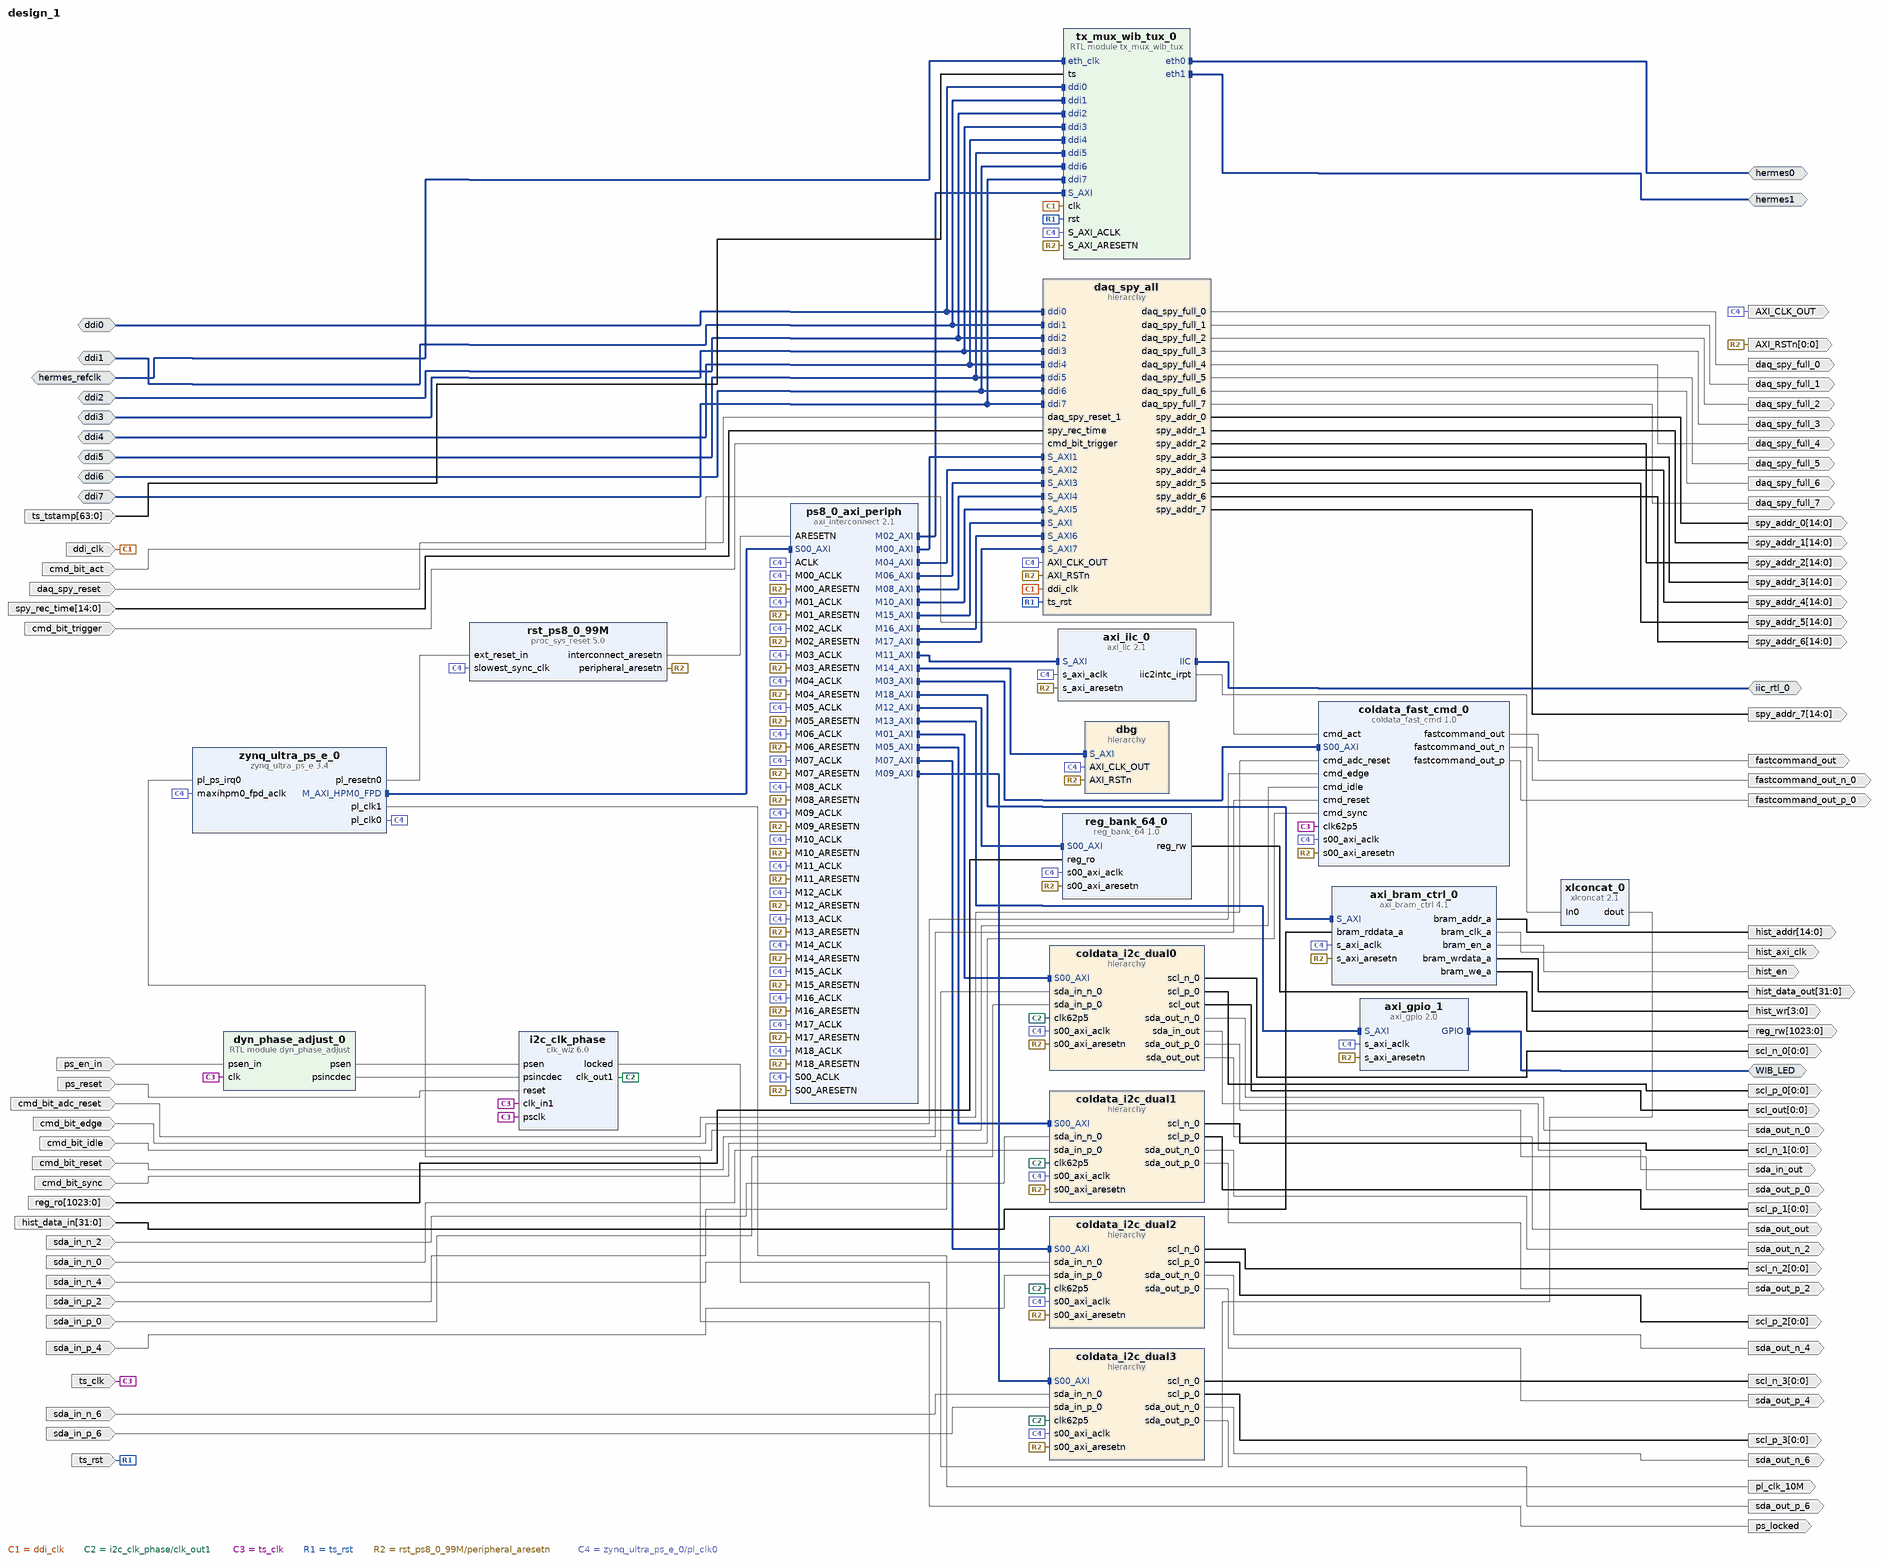
[diagram p0: block diagram of the top level]
# Vivado block design design_1, xczu6cg-ffvb1156-1-e, Vivado 2022.2.2
create_bd_design design_1

create_bd_intf_port -mode Master -vlnv xilinx.com:interface:gpio_rtl:1.0 WIB_LED
create_bd_intf_port -mode Master -vlnv xilinx.com:interface:iic_rtl:1.0 iic_rtl_0
create_bd_intf_port -mode Slave -vlnv xilinx.com:interface:diff_clock_rtl:1.0 hermes_refclk
set_property -dict {CONFIG.FREQ_HZ 125} [get_bd_intf_ports hermes_refclk]
create_bd_intf_port -mode Slave -vlnv UF:user:deimos_data_input_rtl:1.0 ddi0
create_bd_intf_port -mode Slave -vlnv UF:user:deimos_data_input_rtl:1.0 ddi6
create_bd_intf_port -mode Slave -vlnv UF:user:deimos_data_input_rtl:1.0 ddi5
create_bd_intf_port -mode Slave -vlnv UF:user:deimos_data_input_rtl:1.0 ddi1
create_bd_intf_port -mode Slave -vlnv UF:user:deimos_data_input_rtl:1.0 ddi2
create_bd_intf_port -mode Slave -vlnv UF:user:deimos_data_input_rtl:1.0 ddi3
create_bd_intf_port -mode Slave -vlnv UF:user:deimos_data_input_rtl:1.0 ddi4
create_bd_intf_port -mode Slave -vlnv UF:user:deimos_data_input_rtl:1.0 ddi7
create_bd_intf_port -mode Master -vlnv xilinx.com:interface:sgmii_rtl:1.0 hermes0
create_bd_intf_port -mode Master -vlnv xilinx.com:interface:sgmii_rtl:1.0 hermes1
create_bd_port -dir O -type clk AXI_CLK_OUT
create_bd_port -dir O -from 0 -to 0 -type rst AXI_RSTn
create_bd_port -dir I -type rst daq_spy_reset
create_bd_port -dir O fastcommand_out_n_0
create_bd_port -dir O fastcommand_out_p_0
create_bd_port -dir I ps_en_in
create_bd_port -dir O ps_locked
create_bd_port -dir I -type rst ps_reset
set_property -dict {CONFIG.POLARITY ACTIVE_HIGH} [get_bd_ports ps_reset]
create_bd_port -dir I -from 1023 -to 0 reg_ro
create_bd_port -dir O -from 1023 -to 0 reg_rw
create_bd_port -dir O -from 0 -to 0 scl_n_0
create_bd_port -dir O -from 0 -to 0 scl_n_1
create_bd_port -dir O -from 0 -to 0 scl_n_2
create_bd_port -dir O -from 0 -to 0 scl_n_3
create_bd_port -dir O -from 0 -to 0 scl_p_0
create_bd_port -dir O -from 0 -to 0 scl_p_1
create_bd_port -dir O -from 0 -to 0 scl_p_2
create_bd_port -dir O -from 0 -to 0 scl_p_3
create_bd_port -dir I sda_in_n_0
create_bd_port -dir I sda_in_n_2
create_bd_port -dir I sda_in_n_4
create_bd_port -dir I sda_in_n_6
create_bd_port -dir I sda_in_p_0
create_bd_port -dir I sda_in_p_2
create_bd_port -dir I sda_in_p_4
create_bd_port -dir I sda_in_p_6
create_bd_port -dir O sda_out_n_0
create_bd_port -dir O sda_out_n_2
create_bd_port -dir O sda_out_n_4
create_bd_port -dir O sda_out_n_6
create_bd_port -dir O sda_out_p_0
create_bd_port -dir O sda_out_p_2
create_bd_port -dir O sda_out_p_4
create_bd_port -dir O sda_out_p_6
create_bd_port -dir I -from 14 -to 0 spy_rec_time
create_bd_port -dir O -type clk pl_clk_10M
set_property -dict {CONFIG.FREQ_HZ 10000000} [get_bd_ports pl_clk_10M]
create_bd_port -dir I cmd_bit_idle
create_bd_port -dir I cmd_bit_edge
create_bd_port -dir I cmd_bit_sync
create_bd_port -dir I cmd_bit_act
create_bd_port -dir I -type rst cmd_bit_reset
create_bd_port -dir I -type rst cmd_bit_adc_reset
create_bd_port -dir I cmd_bit_trigger
create_bd_port -dir O fastcommand_out
create_bd_port -dir O sda_in_out
create_bd_port -dir O sda_out_out
create_bd_port -dir O -from 0 -to 0 scl_out
create_bd_port -dir I -type clk ts_clk
set_property -dict {CONFIG.FREQ_HZ 62500000} [get_bd_ports ts_clk]
create_bd_port -dir I -from 63 -to 0 ts_tstamp
create_bd_port -dir I -type rst ts_rst
create_bd_port -dir I -type clk ddi_clk
set_property -dict {CONFIG.ASSOCIATED_RESET daq_spy_reset:daq_spy_reset_0:ts_rst CONFIG.FREQ_HZ 62500000} [get_bd_ports ddi_clk]
create_bd_port -dir O -from 14 -to 0 spy_addr_3
create_bd_port -dir O -from 14 -to 0 spy_addr_6
create_bd_port -dir O -from 14 -to 0 spy_addr_4
create_bd_port -dir O daq_spy_full_4
create_bd_port -dir O -from 14 -to 0 spy_addr_5
create_bd_port -dir O daq_spy_full_5
create_bd_port -dir O daq_spy_full_6
create_bd_port -dir O daq_spy_full_1
create_bd_port -dir O daq_spy_full_7
create_bd_port -dir O daq_spy_full_3
create_bd_port -dir O -from 14 -to 0 spy_addr_0
create_bd_port -dir O -from 14 -to 0 spy_addr_7
create_bd_port -dir O -from 14 -to 0 spy_addr_2
create_bd_port -dir O -from 14 -to 0 spy_addr_1
create_bd_port -dir O daq_spy_full_0
create_bd_port -dir O daq_spy_full_2
create_bd_port -dir I -from 31 -to 0 hist_data_in
create_bd_port -dir O -from 31 -to 0 hist_data_out
create_bd_port -dir O -from 14 -to 0 hist_addr
create_bd_port -dir O -type clk hist_axi_clk
create_bd_port -dir O hist_en
create_bd_port -dir O -from 3 -to 0 hist_wr

create_bd_cell -type ip -vlnv user.org:user:coldata_fast_cmd:1.0 coldata_fast_cmd_0
create_bd_cell -type hier coldata_i2c_dual0
create_bd_cell -type hier coldata_i2c_dual1
create_bd_cell -type hier coldata_i2c_dual2
create_bd_cell -type hier coldata_i2c_dual3
create_bd_cell -type hier dbg
create_bd_cell -type module -reference dyn_phase_adjust dyn_phase_adjust_0
create_bd_cell -type ip -vlnv user.org:user:reg_bank_64:1.0 reg_bank_64_0
create_bd_cell -type ip -vlnv xilinx.com:ip:proc_sys_reset:5.0 rst_ps8_0_99M
create_bd_cell -type ip -vlnv xilinx.com:ip:axi_gpio:2.0 axi_gpio_1
set_property -dict [list \
  CONFIG.C_ALL_INPUTS 0 \
  CONFIG.C_ALL_OUTPUTS 1 \
  CONFIG.C_DOUT_DEFAULT 0x0000005a \
  CONFIG.GPIO_BOARD_INTERFACE Custom \
  CONFIG.USE_BOARD_FLOW true \
] [get_bd_cells axi_gpio_1]
create_bd_cell -type ip -vlnv xilinx.com:ip:axi_iic:2.1 axi_iic_0
set_property -dict {CONFIG.IIC_BOARD_INTERFACE Custom CONFIG.USE_BOARD_FLOW true} [get_bd_cells axi_iic_0]
create_bd_cell -type ip -vlnv xilinx.com:ip:clk_wiz:6.0 i2c_clk_phase
set_property -dict [list \
  CONFIG.CLKIN1_JITTER_PS 160.0 \
  CONFIG.CLKOUT1_JITTER 142.224 \
  CONFIG.CLKOUT1_PHASE_ERROR 131.709 \
  CONFIG.CLKOUT1_REQUESTED_OUT_FREQ 62.5 \
  CONFIG.CLK_OUT1_USE_FINE_PS_GUI true \
  CONFIG.MMCM_CLKFBOUT_MULT_F 19.000 \
  CONFIG.MMCM_CLKIN1_PERIOD 16.000 \
  CONFIG.MMCM_CLKIN2_PERIOD 10.0 \
  CONFIG.MMCM_CLKOUT0_DIVIDE_F 19.000 \
  CONFIG.MMCM_CLKOUT0_USE_FINE_PS true \
  CONFIG.MMCM_DIVCLK_DIVIDE 1 \
  CONFIG.USE_DYN_PHASE_SHIFT true \
] [get_bd_cells i2c_clk_phase]
create_bd_cell -type ip -vlnv xilinx.com:ip:axi_interconnect:2.1 ps8_0_axi_periph
set_property -dict {CONFIG.NUM_MI 19} [get_bd_cells ps8_0_axi_periph]
create_bd_cell -type ip -vlnv xilinx.com:ip:zynq_ultra_ps_e:3.4 zynq_ultra_ps_e_0
set_property -dict [list \
  CONFIG.CAN0_BOARD_INTERFACE custom \
  CONFIG.CAN1_BOARD_INTERFACE custom \
  CONFIG.CSU_BOARD_INTERFACE custom \
  CONFIG.DP_BOARD_INTERFACE custom \
  CONFIG.GEM0_BOARD_INTERFACE custom \
  CONFIG.GEM1_BOARD_INTERFACE custom \
  CONFIG.GEM2_BOARD_INTERFACE custom \
  CONFIG.GEM3_BOARD_INTERFACE custom \
  CONFIG.GPIO_BOARD_INTERFACE custom \
  CONFIG.IIC0_BOARD_INTERFACE custom \
  CONFIG.IIC1_BOARD_INTERFACE custom \
  CONFIG.NAND_BOARD_INTERFACE custom \
  CONFIG.PCIE_BOARD_INTERFACE custom \
  CONFIG.PJTAG_BOARD_INTERFACE custom \
  CONFIG.PMU_BOARD_INTERFACE custom \
  CONFIG.PSU_BANK_0_IO_STANDARD LVCMOS18 \
  CONFIG.PSU_BANK_1_IO_STANDARD LVCMOS18 \
  CONFIG.PSU_BANK_2_IO_STANDARD LVCMOS18 \
  CONFIG.PSU_BANK_3_IO_STANDARD LVCMOS18 \
  CONFIG.PSU_DYNAMIC_DDR_CONFIG_EN 1 \
  CONFIG.PSU_USB3__DUAL_CLOCK_ENABLE 0 \
  CONFIG.PSU__ACPU2__POWER__ON 0 \
  CONFIG.PSU__ACPU3__POWER__ON 0 \
  CONFIG.PSU__CAN1__PERIPHERAL__ENABLE 1 \
  CONFIG.PSU__CAN1__PERIPHERAL__IO {MIO 24 .. 25} \
  CONFIG.PSU__CRF_APB__ACPU_CTRL__FREQMHZ 1200 \
  CONFIG.PSU__CRF_APB__ACPU_CTRL__SRCSEL APLL \
  CONFIG.PSU__CRF_APB__APLL_CTRL__SRCSEL PSS_REF_CLK \
  CONFIG.PSU__CRF_APB__DBG_FPD_CTRL__FREQMHZ 250 \
  CONFIG.PSU__CRF_APB__DBG_FPD_CTRL__SRCSEL IOPLL \
  CONFIG.PSU__CRF_APB__DBG_TRACE_CTRL__FREQMHZ 250 \
  CONFIG.PSU__CRF_APB__DBG_TRACE_CTRL__SRCSEL IOPLL \
  CONFIG.PSU__CRF_APB__DBG_TSTMP_CTRL__FREQMHZ 250 \
  CONFIG.PSU__CRF_APB__DBG_TSTMP_CTRL__SRCSEL IOPLL \
  CONFIG.PSU__CRF_APB__DDR_CTRL__FREQMHZ 1067 \
  CONFIG.PSU__CRF_APB__DDR_CTRL__SRCSEL DPLL \
  CONFIG.PSU__CRF_APB__DPDMA_REF_CTRL__FREQMHZ 600 \
  CONFIG.PSU__CRF_APB__DPDMA_REF_CTRL__SRCSEL APLL \
  CONFIG.PSU__CRF_APB__DPLL_CTRL__SRCSEL PSS_REF_CLK \
  CONFIG.PSU__CRF_APB__DP_AUDIO_REF_CTRL__SRCSEL RPLL \
  CONFIG.PSU__CRF_APB__DP_STC_REF_CTRL__SRCSEL RPLL \
  CONFIG.PSU__CRF_APB__DP_VIDEO_REF_CTRL__SRCSEL VPLL \
  CONFIG.PSU__CRF_APB__GDMA_REF_CTRL__FREQMHZ 600 \
  CONFIG.PSU__CRF_APB__GDMA_REF_CTRL__SRCSEL APLL \
  CONFIG.PSU__CRF_APB__GPU_REF_CTRL__FREQMHZ 500 \
  CONFIG.PSU__CRF_APB__GPU_REF_CTRL__SRCSEL IOPLL \
  CONFIG.PSU__CRF_APB__TOPSW_LSBUS_CTRL__FREQMHZ 100 \
  CONFIG.PSU__CRF_APB__TOPSW_LSBUS_CTRL__SRCSEL IOPLL \
  CONFIG.PSU__CRF_APB__TOPSW_MAIN_CTRL__FREQMHZ 533.33 \
  CONFIG.PSU__CRF_APB__TOPSW_MAIN_CTRL__SRCSEL DPLL \
  CONFIG.PSU__CRF_APB__VPLL_CTRL__SRCSEL PSS_REF_CLK \
  CONFIG.PSU__CRL_APB__ADMA_REF_CTRL__FREQMHZ 500 \
  CONFIG.PSU__CRL_APB__ADMA_REF_CTRL__SRCSEL IOPLL \
  CONFIG.PSU__CRL_APB__CAN1_REF_CTRL__FREQMHZ 100 \
  CONFIG.PSU__CRL_APB__CAN1_REF_CTRL__SRCSEL IOPLL \
  CONFIG.PSU__CRL_APB__CPU_R5_CTRL__FREQMHZ 500 \
  CONFIG.PSU__CRL_APB__CPU_R5_CTRL__SRCSEL IOPLL \
  CONFIG.PSU__CRL_APB__DBG_LPD_CTRL__FREQMHZ 250 \
  CONFIG.PSU__CRL_APB__DBG_LPD_CTRL__SRCSEL IOPLL \
  CONFIG.PSU__CRL_APB__GEM3_REF_CTRL__FREQMHZ 125 \
  CONFIG.PSU__CRL_APB__GEM3_REF_CTRL__SRCSEL IOPLL \
  CONFIG.PSU__CRL_APB__I2C0_REF_CTRL__FREQMHZ 100 \
  CONFIG.PSU__CRL_APB__I2C0_REF_CTRL__SRCSEL IOPLL \
  CONFIG.PSU__CRL_APB__I2C1_REF_CTRL__FREQMHZ 100 \
  CONFIG.PSU__CRL_APB__I2C1_REF_CTRL__SRCSEL IOPLL \
  CONFIG.PSU__CRL_APB__IOPLL_CTRL__SRCSEL PSS_REF_CLK \
  CONFIG.PSU__CRL_APB__IOU_SWITCH_CTRL__FREQMHZ 250 \
  CONFIG.PSU__CRL_APB__IOU_SWITCH_CTRL__SRCSEL IOPLL \
  CONFIG.PSU__CRL_APB__LPD_LSBUS_CTRL__FREQMHZ 100 \
  CONFIG.PSU__CRL_APB__LPD_LSBUS_CTRL__SRCSEL IOPLL \
  CONFIG.PSU__CRL_APB__LPD_SWITCH_CTRL__FREQMHZ 500 \
  CONFIG.PSU__CRL_APB__LPD_SWITCH_CTRL__SRCSEL IOPLL \
  CONFIG.PSU__CRL_APB__PCAP_CTRL__FREQMHZ 200 \
  CONFIG.PSU__CRL_APB__PCAP_CTRL__SRCSEL IOPLL \
  CONFIG.PSU__CRL_APB__PL0_REF_CTRL__FREQMHZ 100 \
  CONFIG.PSU__CRL_APB__PL0_REF_CTRL__SRCSEL IOPLL \
  CONFIG.PSU__CRL_APB__PL1_REF_CTRL__FREQMHZ 10 \
  CONFIG.PSU__CRL_APB__QSPI_REF_CTRL__FREQMHZ 125 \
  CONFIG.PSU__CRL_APB__QSPI_REF_CTRL__SRCSEL IOPLL \
  CONFIG.PSU__CRL_APB__RPLL_CTRL__SRCSEL PSS_REF_CLK \
  CONFIG.PSU__CRL_APB__SDIO1_REF_CTRL__FREQMHZ 200 \
  CONFIG.PSU__CRL_APB__SDIO1_REF_CTRL__SRCSEL IOPLL \
  CONFIG.PSU__CRL_APB__TIMESTAMP_REF_CTRL__FREQMHZ 100 \
  CONFIG.PSU__CRL_APB__TIMESTAMP_REF_CTRL__SRCSEL IOPLL \
  CONFIG.PSU__CRL_APB__UART0_REF_CTRL__FREQMHZ 100 \
  CONFIG.PSU__CRL_APB__UART0_REF_CTRL__SRCSEL IOPLL \
  CONFIG.PSU__CRL_APB__UART1_REF_CTRL__FREQMHZ 100 \
  CONFIG.PSU__CRL_APB__UART1_REF_CTRL__SRCSEL IOPLL \
  CONFIG.PSU__CRL_APB__USB0_BUS_REF_CTRL__FREQMHZ 250 \
  CONFIG.PSU__CRL_APB__USB0_BUS_REF_CTRL__SRCSEL IOPLL \
  CONFIG.PSU__CRL_APB__USB3_DUAL_REF_CTRL__FREQMHZ 20 \
  CONFIG.PSU__CRL_APB__USB3_DUAL_REF_CTRL__SRCSEL IOPLL \
  CONFIG.PSU__CRL_APB__USB3__ENABLE 0 \
  CONFIG.PSU__CSUPMU__PERIPHERAL__VALID 0 \
  CONFIG.PSU__DDRC__BUS_WIDTH {64 Bit} \
  CONFIG.PSU__DDRC__COMPONENTS UDIMM \
  CONFIG.PSU__DDRC__DEVICE_CAPACITY {8192 MBits} \
  CONFIG.PSU__DDRC__DRAM_WIDTH {16 Bits} \
  CONFIG.PSU__DDRC__ECC Disabled \
  CONFIG.PSU__DDRC__MEMORY_TYPE {DDR 4} \
  CONFIG.PSU__DDRC__SPEED_BIN DDR4_2133P \
  CONFIG.PSU__DDR_HIGH_ADDRESS_GUI_ENABLE 1 \
  CONFIG.PSU__DDR__INTERFACE__FREQMHZ 533.500 \
  CONFIG.PSU__DEVICE_TYPE CG \
  CONFIG.PSU__DISPLAYPORT__PERIPHERAL__ENABLE 0 \
  CONFIG.PSU__DLL__ISUSED 1 \
  CONFIG.PSU__ENET0__PERIPHERAL__ENABLE 1 \
  CONFIG.PSU__ENET0__PERIPHERAL__IO {GT Lane0} \
  CONFIG.PSU__ENET3__PERIPHERAL__ENABLE 0 \
  CONFIG.PSU__FPD_SLCR__WDT1__FREQMHZ 100 \
  CONFIG.PSU__FPGA_PL0_ENABLE 1 \
  CONFIG.PSU__FPGA_PL1_ENABLE 1 \
  CONFIG.PSU__GEM0__REF_CLK_FREQ 125 \
  CONFIG.PSU__GEM0__REF_CLK_SEL {Ref Clk0} \
  CONFIG.PSU__GEM__TSU__ENABLE 0 \
  CONFIG.PSU__GPIO0_MIO__PERIPHERAL__ENABLE 0 \
  CONFIG.PSU__GPIO1_MIO__PERIPHERAL__ENABLE 0 \
  CONFIG.PSU__GPU_PP0__POWER__ON 0 \
  CONFIG.PSU__GPU_PP1__POWER__ON 0 \
  CONFIG.PSU__I2C0__PERIPHERAL__ENABLE 1 \
  CONFIG.PSU__I2C0__PERIPHERAL__IO {MIO 14 .. 15} \
  CONFIG.PSU__I2C1__PERIPHERAL__ENABLE 1 \
  CONFIG.PSU__I2C1__PERIPHERAL__IO {MIO 16 .. 17} \
  CONFIG.PSU__IOU_SLCR__IOU_TTC_APB_CLK__TTC0_SEL APB \
  CONFIG.PSU__IOU_SLCR__IOU_TTC_APB_CLK__TTC1_SEL APB \
  CONFIG.PSU__IOU_SLCR__IOU_TTC_APB_CLK__TTC2_SEL APB \
  CONFIG.PSU__IOU_SLCR__IOU_TTC_APB_CLK__TTC3_SEL APB \
  CONFIG.PSU__IOU_SLCR__TTC0__FREQMHZ 100 \
  CONFIG.PSU__IOU_SLCR__TTC1__FREQMHZ 100 \
  CONFIG.PSU__IOU_SLCR__TTC2__FREQMHZ 100 \
  CONFIG.PSU__IOU_SLCR__TTC3__FREQMHZ 100 \
  CONFIG.PSU__IOU_SLCR__WDT0__FREQMHZ 100 \
  CONFIG.PSU__LPD_SLCR__CSUPMU__FREQMHZ 100 \
  CONFIG.PSU__MAXIGP0__DATA_WIDTH 128 \
  CONFIG.PSU__OVERRIDE_HPX_QOS 0 \
  CONFIG.PSU__OVERRIDE__BASIC_CLOCK 0 \
  CONFIG.PSU__PCIE__CLASS_CODE_BASE 0x06 \
  CONFIG.PSU__PCIE__CLASS_CODE_INTERFACE 0x0 \
  CONFIG.PSU__PCIE__CLASS_CODE_SUB 0x4 \
  CONFIG.PSU__PCIE__DEVICE_ID 0xD021 \
  CONFIG.PSU__PCIE__REVISION_ID 0x0 \
  CONFIG.PSU__PCIE__SUBSYSTEM_ID 0x7 \
  CONFIG.PSU__PCIE__SUBSYSTEM_VENDOR_ID 0x10EE \
  CONFIG.PSU__PCIE__VENDOR_ID 0x10EE \
  CONFIG.PSU__PMU__GPO2__POLARITY low \
  CONFIG.PSU__PMU__GPO3__POLARITY low \
  CONFIG.PSU__PMU__GPO4__POLARITY low \
  CONFIG.PSU__PMU__GPO5__POLARITY low \
  CONFIG.PSU__PMU__PERIPHERAL__ENABLE 0 \
  CONFIG.PSU__PRESET_APPLIED 1 \
  CONFIG.PSU__PSS_REF_CLK__FREQMHZ 33.333333 \
  CONFIG.PSU__QSPI_COHERENCY 0 \
  CONFIG.PSU__QSPI_ROUTE_THROUGH_FPD 0 \
  CONFIG.PSU__QSPI__GRP_FBCLK__ENABLE 0 \
  CONFIG.PSU__QSPI__PERIPHERAL__DATA_MODE x4 \
  CONFIG.PSU__QSPI__PERIPHERAL__ENABLE 1 \
  CONFIG.PSU__QSPI__PERIPHERAL__IO {MIO 0 .. 12} \
  CONFIG.PSU__QSPI__PERIPHERAL__MODE {Dual Parallel} \
  CONFIG.PSU__SATA__PERIPHERAL__ENABLE 0 \
  CONFIG.PSU__SD0__CLK_100_SDR_OTAP_DLY 0x3 \
  CONFIG.PSU__SD0__CLK_200_SDR_OTAP_DLY 0x3 \
  CONFIG.PSU__SD0__CLK_50_DDR_ITAP_DLY 0x3D \
  CONFIG.PSU__SD0__CLK_50_DDR_OTAP_DLY 0x4 \
  CONFIG.PSU__SD0__CLK_50_SDR_ITAP_DLY 0x15 \
  CONFIG.PSU__SD0__CLK_50_SDR_OTAP_DLY 0x5 \
  CONFIG.PSU__SD1_COHERENCY 0 \
  CONFIG.PSU__SD1_ROUTE_THROUGH_FPD 0 \
  CONFIG.PSU__SD1__CLK_50_SDR_ITAP_DLY 0x15 \
  CONFIG.PSU__SD1__CLK_50_SDR_OTAP_DLY 0x5 \
  CONFIG.PSU__SD1__DATA_TRANSFER_MODE 4Bit \
  CONFIG.PSU__SD1__GRP_CD__ENABLE 1 \
  CONFIG.PSU__SD1__GRP_CD__IO {MIO 45} \
  CONFIG.PSU__SD1__GRP_POW__ENABLE 0 \
  CONFIG.PSU__SD1__GRP_WP__ENABLE 0 \
  CONFIG.PSU__SD1__PERIPHERAL__ENABLE 1 \
  CONFIG.PSU__SD1__PERIPHERAL__IO {MIO 46 .. 51} \
  CONFIG.PSU__SD1__SLOT_TYPE {SD 2.0} \
  CONFIG.PSU__SWDT0__PERIPHERAL__ENABLE 0 \
  CONFIG.PSU__SWDT1__PERIPHERAL__ENABLE 0 \
  CONFIG.PSU__TSU__BUFG_PORT_PAIR 0 \
  CONFIG.PSU__TTC0__PERIPHERAL__ENABLE 0 \
  CONFIG.PSU__TTC1__PERIPHERAL__ENABLE 0 \
  CONFIG.PSU__TTC2__PERIPHERAL__ENABLE 0 \
  CONFIG.PSU__TTC3__PERIPHERAL__ENABLE 0 \
  CONFIG.PSU__UART0__BAUD_RATE 115200 \
  CONFIG.PSU__UART0__MODEM__ENABLE 0 \
  CONFIG.PSU__UART0__PERIPHERAL__ENABLE 1 \
  CONFIG.PSU__UART0__PERIPHERAL__IO {MIO 18 .. 19} \
  CONFIG.PSU__UART1__PERIPHERAL__ENABLE 0 \
  CONFIG.PSU__USB0__PERIPHERAL__ENABLE 0 \
  CONFIG.PSU__USE__IRQ0 1 \
  CONFIG.PSU__USE__M_AXI_GP0 1 \
  CONFIG.PSU__USE__M_AXI_GP1 0 \
  CONFIG.PSU__USE__M_AXI_GP2 0 \
  CONFIG.QSPI_BOARD_INTERFACE custom \
  CONFIG.SATA_BOARD_INTERFACE custom \
  CONFIG.SD0_BOARD_INTERFACE custom \
  CONFIG.SD1_BOARD_INTERFACE custom \
  CONFIG.SPI0_BOARD_INTERFACE custom \
  CONFIG.SPI1_BOARD_INTERFACE custom \
  CONFIG.SUBPRESET1 Custom \
  CONFIG.SUBPRESET2 Custom \
  CONFIG.SWDT0_BOARD_INTERFACE custom \
  CONFIG.SWDT1_BOARD_INTERFACE custom \
  CONFIG.TRACE_BOARD_INTERFACE custom \
  CONFIG.TTC0_BOARD_INTERFACE custom \
  CONFIG.TTC1_BOARD_INTERFACE custom \
  CONFIG.TTC2_BOARD_INTERFACE custom \
  CONFIG.TTC3_BOARD_INTERFACE custom \
  CONFIG.UART0_BOARD_INTERFACE custom \
  CONFIG.UART1_BOARD_INTERFACE custom \
  CONFIG.USB0_BOARD_INTERFACE custom \
  CONFIG.USB1_BOARD_INTERFACE custom \
  CONFIG.preset None \
] [get_bd_cells zynq_ultra_ps_e_0]
# 796 more settings of zynq_ultra_ps_e_0 are not shown: defaults, MIO pin electricals, DDR timing, and values the tool derives
create_bd_cell -type hier daq_spy_all
create_bd_cell -type ip -vlnv xilinx.com:ip:xlconcat:2.1 xlconcat_0
create_bd_cell -type ip -vlnv xilinx.com:ip:axi_bram_ctrl:4.1 axi_bram_ctrl_0
set_property -dict {CONFIG.READ_LATENCY 2 CONFIG.SINGLE_PORT_BRAM 1} [get_bd_cells axi_bram_ctrl_0]
create_bd_cell -type module -reference tx_mux_wib_tux tx_mux_wib_tux_0

# ---- hierarchy /coldata_i2c_dual0 ----
current_bd_instance /coldata_i2c_dual0
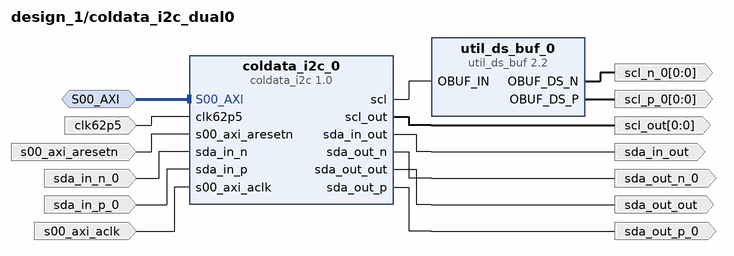
[diagram p1: block diagram inside /coldata_i2c_dual0]
create_bd_intf_pin -mode Slave -vlnv xilinx.com:interface:aximm_rtl:1.0 S00_AXI
create_bd_pin -dir O -from 0 -to 0 scl_out
create_bd_pin -dir I clk62p5
create_bd_pin -dir I -type clk s00_axi_aclk
create_bd_pin -dir I -type rst s00_axi_aresetn
create_bd_pin -dir O -from 0 -to 0 -type clk scl_n_0
create_bd_pin -dir O -from 0 -to 0 -type clk scl_p_0
create_bd_pin -dir I sda_in_n_0
create_bd_pin -dir O sda_in_out
create_bd_pin -dir I sda_in_p_0
create_bd_pin -dir O sda_out_n_0
create_bd_pin -dir O sda_out_out
create_bd_pin -dir O sda_out_p_0

create_bd_cell -type ip -vlnv user.org:user:coldata_i2c:1.0 coldata_i2c_0
create_bd_cell -type ip -vlnv xilinx.com:ip:util_ds_buf:2.2 util_ds_buf_0
set_property -dict {CONFIG.C_BUF_TYPE OBUFDS} [get_bd_cells util_ds_buf_0]

# ---- hierarchy /coldata_i2c_dual1 ----
current_bd_instance /coldata_i2c_dual1
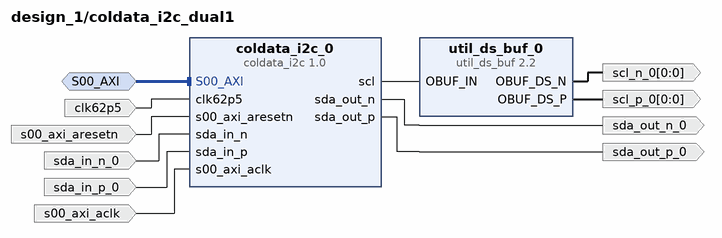
[diagram p2: block diagram inside /coldata_i2c_dual1]
create_bd_intf_pin -mode Slave -vlnv xilinx.com:interface:aximm_rtl:1.0 S00_AXI
create_bd_pin -dir I clk62p5
create_bd_pin -dir I -type clk s00_axi_aclk
create_bd_pin -dir I -type rst s00_axi_aresetn
create_bd_pin -dir O -from 0 -to 0 -type clk scl_n_0
create_bd_pin -dir O -from 0 -to 0 -type clk scl_p_0
create_bd_pin -dir I sda_in_n_0
create_bd_pin -dir I sda_in_p_0
create_bd_pin -dir O sda_out_n_0
create_bd_pin -dir O sda_out_p_0

create_bd_cell -type ip -vlnv user.org:user:coldata_i2c:1.0 coldata_i2c_0
create_bd_cell -type ip -vlnv xilinx.com:ip:util_ds_buf:2.2 util_ds_buf_0
set_property -dict {CONFIG.C_BUF_TYPE OBUFDS} [get_bd_cells util_ds_buf_0]

# ---- hierarchy /coldata_i2c_dual2 ----
current_bd_instance /coldata_i2c_dual2
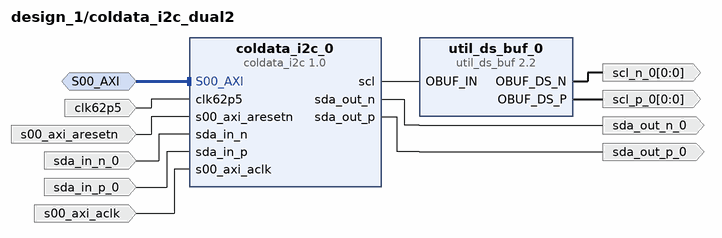
[diagram p3: block diagram inside /coldata_i2c_dual2]
create_bd_intf_pin -mode Slave -vlnv xilinx.com:interface:aximm_rtl:1.0 S00_AXI
create_bd_pin -dir I clk62p5
create_bd_pin -dir I -type clk s00_axi_aclk
create_bd_pin -dir I -type rst s00_axi_aresetn
create_bd_pin -dir O -from 0 -to 0 -type clk scl_n_0
create_bd_pin -dir O -from 0 -to 0 -type clk scl_p_0
create_bd_pin -dir I sda_in_n_0
create_bd_pin -dir I sda_in_p_0
create_bd_pin -dir O sda_out_n_0
create_bd_pin -dir O sda_out_p_0

create_bd_cell -type ip -vlnv user.org:user:coldata_i2c:1.0 coldata_i2c_0
create_bd_cell -type ip -vlnv xilinx.com:ip:util_ds_buf:2.2 util_ds_buf_0
set_property -dict {CONFIG.C_BUF_TYPE OBUFDS} [get_bd_cells util_ds_buf_0]

# ---- hierarchy /coldata_i2c_dual3 ----
current_bd_instance /coldata_i2c_dual3
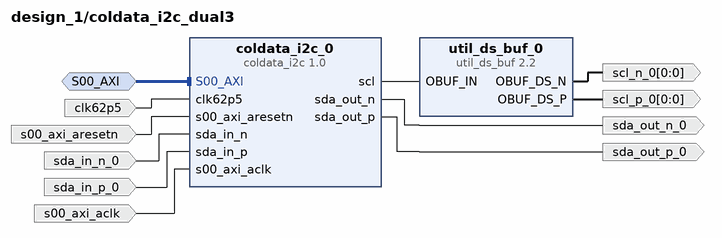
[diagram p4: block diagram inside /coldata_i2c_dual3]
create_bd_intf_pin -mode Slave -vlnv xilinx.com:interface:aximm_rtl:1.0 S00_AXI
create_bd_pin -dir I clk62p5
create_bd_pin -dir I -type clk s00_axi_aclk
create_bd_pin -dir I -type rst s00_axi_aresetn
create_bd_pin -dir O -from 0 -to 0 -type clk scl_n_0
create_bd_pin -dir O -from 0 -to 0 -type clk scl_p_0
create_bd_pin -dir I sda_in_n_0
create_bd_pin -dir I sda_in_p_0
create_bd_pin -dir O sda_out_n_0
create_bd_pin -dir O sda_out_p_0

create_bd_cell -type ip -vlnv user.org:user:coldata_i2c:1.0 coldata_i2c_0
create_bd_cell -type ip -vlnv xilinx.com:ip:util_ds_buf:2.2 util_ds_buf_0
set_property -dict {CONFIG.C_BUF_TYPE OBUFDS} [get_bd_cells util_ds_buf_0]

# ---- hierarchy /dbg ----
current_bd_instance /dbg
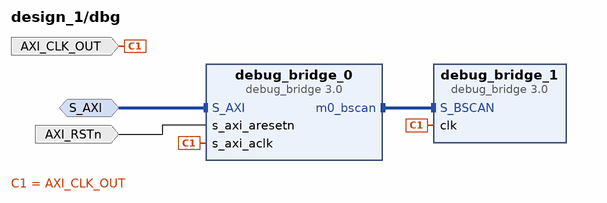
[diagram p5: block diagram inside /dbg]
create_bd_intf_pin -mode Slave -vlnv xilinx.com:interface:aximm_rtl:1.0 S_AXI
create_bd_pin -dir I -type clk AXI_CLK_OUT
create_bd_pin -dir I -type rst AXI_RSTn

create_bd_cell -type ip -vlnv xilinx.com:ip:debug_bridge:3.0 debug_bridge_0
set_property -dict {CONFIG.C_DEBUG_MODE 2 CONFIG.C_NUM_BS_MASTER 1} [get_bd_cells debug_bridge_0]
create_bd_cell -type ip -vlnv xilinx.com:ip:debug_bridge:3.0 debug_bridge_1

# ---- hierarchy /daq_spy_all ----
current_bd_instance /daq_spy_all
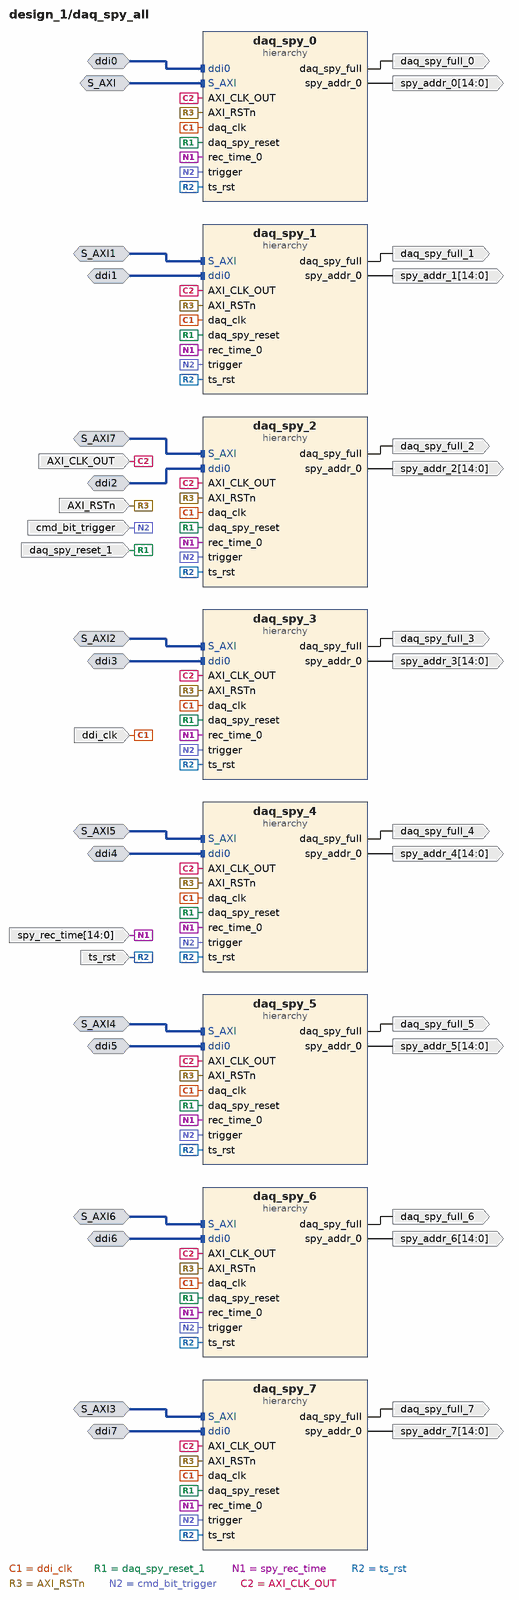
[diagram p6: block diagram inside /daq_spy_all]
create_bd_intf_pin -mode Slave -vlnv xilinx.com:interface:aximm_rtl:1.0 S_AXI
create_bd_intf_pin -mode Monitor -vlnv UF:user:deimos_data_input_rtl:1.0 ddi0
create_bd_intf_pin -mode Slave -vlnv xilinx.com:interface:aximm_rtl:1.0 S_AXI1
create_bd_intf_pin -mode Slave -vlnv xilinx.com:interface:aximm_rtl:1.0 S_AXI2
create_bd_intf_pin -mode Slave -vlnv xilinx.com:interface:aximm_rtl:1.0 S_AXI3
create_bd_intf_pin -mode Slave -vlnv xilinx.com:interface:aximm_rtl:1.0 S_AXI4
create_bd_intf_pin -mode Slave -vlnv xilinx.com:interface:aximm_rtl:1.0 S_AXI5
create_bd_intf_pin -mode Slave -vlnv xilinx.com:interface:aximm_rtl:1.0 S_AXI6
create_bd_intf_pin -mode Slave -vlnv xilinx.com:interface:aximm_rtl:1.0 S_AXI7
create_bd_intf_pin -mode Monitor -vlnv UF:user:deimos_data_input_rtl:1.0 ddi1
create_bd_intf_pin -mode Monitor -vlnv UF:user:deimos_data_input_rtl:1.0 ddi3
create_bd_intf_pin -mode Monitor -vlnv UF:user:deimos_data_input_rtl:1.0 ddi7
create_bd_intf_pin -mode Monitor -vlnv UF:user:deimos_data_input_rtl:1.0 ddi5
create_bd_intf_pin -mode Monitor -vlnv UF:user:deimos_data_input_rtl:1.0 ddi4
create_bd_intf_pin -mode Monitor -vlnv UF:user:deimos_data_input_rtl:1.0 ddi6
create_bd_intf_pin -mode Monitor -vlnv UF:user:deimos_data_input_rtl:1.0 ddi2
create_bd_pin -dir I -type clk AXI_CLK_OUT
create_bd_pin -dir I -type rst AXI_RSTn
create_bd_pin -dir I -type clk ddi_clk
create_bd_pin -dir O daq_spy_full_0
create_bd_pin -dir I -type rst daq_spy_reset_1
create_bd_pin -dir I -from 14 -to 0 spy_rec_time
create_bd_pin -dir O -from 14 -to 0 spy_addr_0
create_bd_pin -dir I cmd_bit_trigger
create_bd_pin -dir I -type rst ts_rst
create_bd_pin -dir O daq_spy_full_3
create_bd_pin -dir O -from 14 -to 0 spy_addr_7
create_bd_pin -dir O daq_spy_full_1
create_bd_pin -dir O -from 14 -to 0 spy_addr_5
create_bd_pin -dir O -from 14 -to 0 spy_addr_4
create_bd_pin -dir O -from 14 -to 0 spy_addr_3
create_bd_pin -dir O -from 14 -to 0 spy_addr_1
create_bd_pin -dir O daq_spy_full_7
create_bd_pin -dir O daq_spy_full_6
create_bd_pin -dir O daq_spy_full_5
create_bd_pin -dir O daq_spy_full_4
create_bd_pin -dir O -from 14 -to 0 spy_addr_6
create_bd_pin -dir O -from 14 -to 0 spy_addr_2
create_bd_pin -dir O daq_spy_full_2

create_bd_cell -type hier daq_spy_1
create_bd_cell -type hier daq_spy_3
create_bd_cell -type hier daq_spy_4
create_bd_cell -type hier daq_spy_5
create_bd_cell -type hier daq_spy_6
create_bd_cell -type hier daq_spy_7
create_bd_cell -type hier daq_spy_0
create_bd_cell -type hier daq_spy_2

# ---- hierarchy /daq_spy_all/daq_spy_1 ----
current_bd_instance /daq_spy_all/daq_spy_1
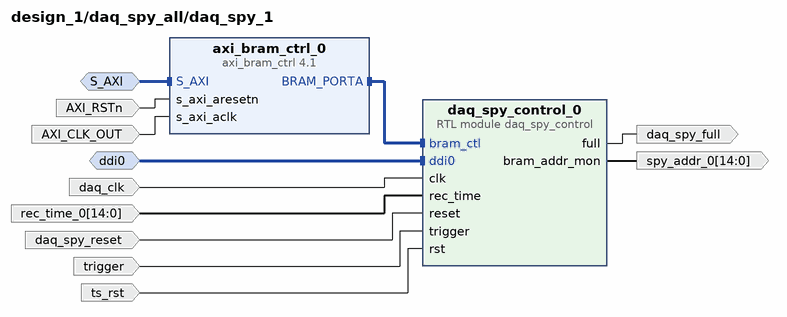
[diagram p7: block diagram inside /daq_spy_all/daq_spy_1]
create_bd_intf_pin -mode Slave -vlnv xilinx.com:interface:aximm_rtl:1.0 S_AXI
create_bd_intf_pin -mode Monitor -vlnv UF:user:deimos_data_input_rtl:1.0 ddi0
create_bd_pin -dir I -type clk AXI_CLK_OUT
create_bd_pin -dir I -type rst AXI_RSTn
create_bd_pin -dir I -type clk daq_clk
create_bd_pin -dir O daq_spy_full
create_bd_pin -dir I -type rst daq_spy_reset
create_bd_pin -dir I -from 14 -to 0 rec_time_0
create_bd_pin -dir O -from 14 -to 0 spy_addr_0
create_bd_pin -dir I trigger
create_bd_pin -dir I -type rst ts_rst

create_bd_cell -type ip -vlnv xilinx.com:ip:axi_bram_ctrl:4.1 axi_bram_ctrl_0
set_property -dict {CONFIG.DATA_WIDTH 64 CONFIG.SINGLE_PORT_BRAM 1} [get_bd_cells axi_bram_ctrl_0]
create_bd_cell -type module -reference daq_spy_control daq_spy_control_0

# ---- hierarchy /daq_spy_all/daq_spy_3 ----
current_bd_instance /daq_spy_all/daq_spy_3
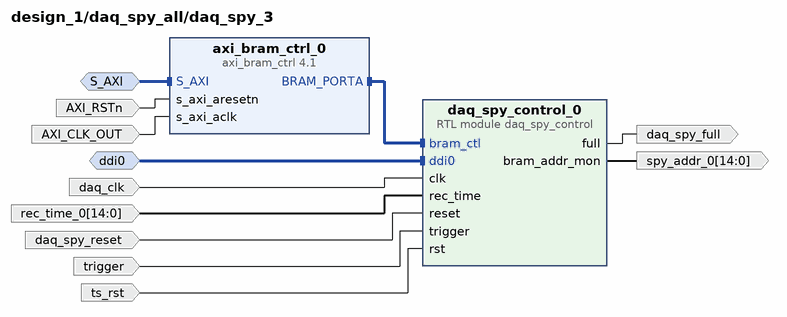
[diagram p8: block diagram inside /daq_spy_all/daq_spy_3]
create_bd_intf_pin -mode Slave -vlnv xilinx.com:interface:aximm_rtl:1.0 S_AXI
create_bd_intf_pin -mode Monitor -vlnv UF:user:deimos_data_input_rtl:1.0 ddi0
create_bd_pin -dir I -type clk AXI_CLK_OUT
create_bd_pin -dir I -type rst AXI_RSTn
create_bd_pin -dir I -type clk daq_clk
create_bd_pin -dir O daq_spy_full
create_bd_pin -dir I -type rst daq_spy_reset
create_bd_pin -dir I -from 14 -to 0 rec_time_0
create_bd_pin -dir O -from 14 -to 0 spy_addr_0
create_bd_pin -dir I trigger
create_bd_pin -dir I -type rst ts_rst

create_bd_cell -type ip -vlnv xilinx.com:ip:axi_bram_ctrl:4.1 axi_bram_ctrl_0
set_property -dict {CONFIG.DATA_WIDTH 64 CONFIG.SINGLE_PORT_BRAM 1} [get_bd_cells axi_bram_ctrl_0]
create_bd_cell -type module -reference daq_spy_control daq_spy_control_0

# ---- hierarchy /daq_spy_all/daq_spy_4 ----
current_bd_instance /daq_spy_all/daq_spy_4
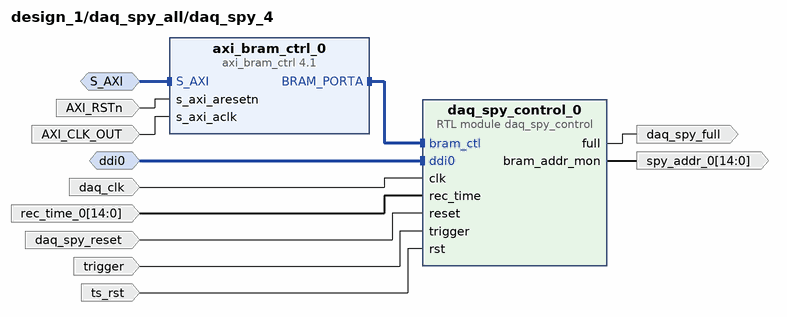
[diagram p9: block diagram inside /daq_spy_all/daq_spy_4]
create_bd_intf_pin -mode Slave -vlnv xilinx.com:interface:aximm_rtl:1.0 S_AXI
create_bd_intf_pin -mode Monitor -vlnv UF:user:deimos_data_input_rtl:1.0 ddi0
create_bd_pin -dir I -type clk AXI_CLK_OUT
create_bd_pin -dir I -type rst AXI_RSTn
create_bd_pin -dir I -type clk daq_clk
create_bd_pin -dir O daq_spy_full
create_bd_pin -dir I -type rst daq_spy_reset
create_bd_pin -dir I -from 14 -to 0 rec_time_0
create_bd_pin -dir O -from 14 -to 0 spy_addr_0
create_bd_pin -dir I trigger
create_bd_pin -dir I -type rst ts_rst

create_bd_cell -type ip -vlnv xilinx.com:ip:axi_bram_ctrl:4.1 axi_bram_ctrl_0
set_property -dict {CONFIG.DATA_WIDTH 64 CONFIG.SINGLE_PORT_BRAM 1} [get_bd_cells axi_bram_ctrl_0]
create_bd_cell -type module -reference daq_spy_control daq_spy_control_0

# ---- hierarchy /daq_spy_all/daq_spy_5 ----
current_bd_instance /daq_spy_all/daq_spy_5
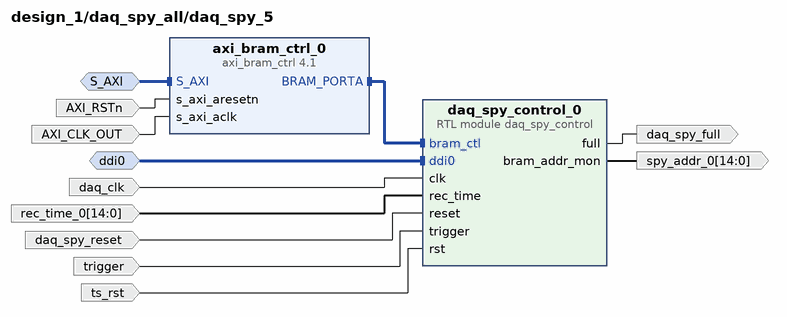
[diagram p10: block diagram inside /daq_spy_all/daq_spy_5]
create_bd_intf_pin -mode Slave -vlnv xilinx.com:interface:aximm_rtl:1.0 S_AXI
create_bd_intf_pin -mode Monitor -vlnv UF:user:deimos_data_input_rtl:1.0 ddi0
create_bd_pin -dir I -type clk AXI_CLK_OUT
create_bd_pin -dir I -type rst AXI_RSTn
create_bd_pin -dir I -type clk daq_clk
create_bd_pin -dir O daq_spy_full
create_bd_pin -dir I -type rst daq_spy_reset
create_bd_pin -dir I -from 14 -to 0 rec_time_0
create_bd_pin -dir O -from 14 -to 0 spy_addr_0
create_bd_pin -dir I trigger
create_bd_pin -dir I -type rst ts_rst

create_bd_cell -type ip -vlnv xilinx.com:ip:axi_bram_ctrl:4.1 axi_bram_ctrl_0
set_property -dict {CONFIG.DATA_WIDTH 64 CONFIG.SINGLE_PORT_BRAM 1} [get_bd_cells axi_bram_ctrl_0]
create_bd_cell -type module -reference daq_spy_control daq_spy_control_0

# ---- hierarchy /daq_spy_all/daq_spy_6 ----
current_bd_instance /daq_spy_all/daq_spy_6
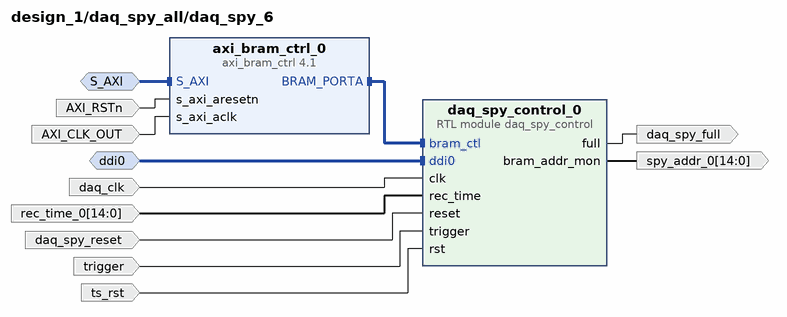
[diagram p11: block diagram inside /daq_spy_all/daq_spy_6]
create_bd_intf_pin -mode Slave -vlnv xilinx.com:interface:aximm_rtl:1.0 S_AXI
create_bd_intf_pin -mode Monitor -vlnv UF:user:deimos_data_input_rtl:1.0 ddi0
create_bd_pin -dir I -type clk AXI_CLK_OUT
create_bd_pin -dir I -type rst AXI_RSTn
create_bd_pin -dir I -type clk daq_clk
create_bd_pin -dir O daq_spy_full
create_bd_pin -dir I -type rst daq_spy_reset
create_bd_pin -dir I -from 14 -to 0 rec_time_0
create_bd_pin -dir O -from 14 -to 0 spy_addr_0
create_bd_pin -dir I trigger
create_bd_pin -dir I -type rst ts_rst

create_bd_cell -type ip -vlnv xilinx.com:ip:axi_bram_ctrl:4.1 axi_bram_ctrl_0
set_property -dict {CONFIG.DATA_WIDTH 64 CONFIG.SINGLE_PORT_BRAM 1} [get_bd_cells axi_bram_ctrl_0]
create_bd_cell -type module -reference daq_spy_control daq_spy_control_0

# ---- hierarchy /daq_spy_all/daq_spy_7 ----
current_bd_instance /daq_spy_all/daq_spy_7
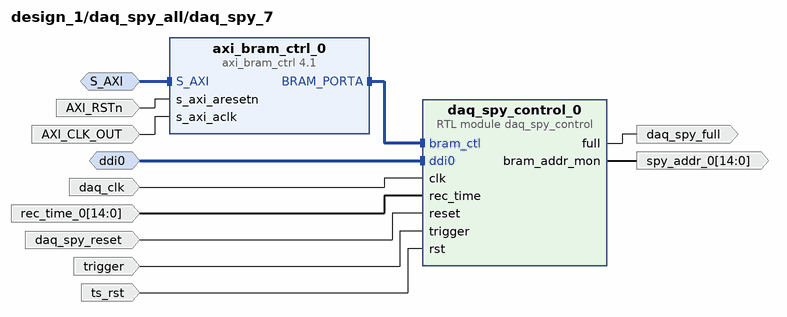
[diagram p12: block diagram inside /daq_spy_all/daq_spy_7]
create_bd_intf_pin -mode Slave -vlnv xilinx.com:interface:aximm_rtl:1.0 S_AXI
create_bd_intf_pin -mode Monitor -vlnv UF:user:deimos_data_input_rtl:1.0 ddi0
create_bd_pin -dir I -type clk AXI_CLK_OUT
create_bd_pin -dir I -type rst AXI_RSTn
create_bd_pin -dir I -type clk daq_clk
create_bd_pin -dir O daq_spy_full
create_bd_pin -dir I -type rst daq_spy_reset
create_bd_pin -dir I -from 14 -to 0 rec_time_0
create_bd_pin -dir O -from 14 -to 0 spy_addr_0
create_bd_pin -dir I trigger
create_bd_pin -dir I -type rst ts_rst

create_bd_cell -type ip -vlnv xilinx.com:ip:axi_bram_ctrl:4.1 axi_bram_ctrl_0
set_property -dict {CONFIG.DATA_WIDTH 64 CONFIG.SINGLE_PORT_BRAM 1} [get_bd_cells axi_bram_ctrl_0]
create_bd_cell -type module -reference daq_spy_control daq_spy_control_0

# ---- hierarchy /daq_spy_all/daq_spy_0 ----
current_bd_instance /daq_spy_all/daq_spy_0
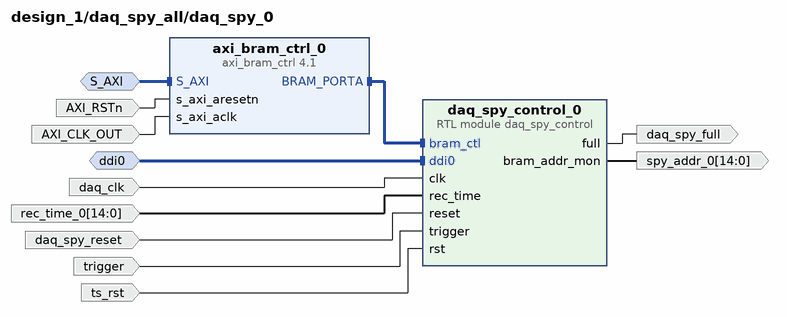
[diagram p13: block diagram inside /daq_spy_all/daq_spy_0]
create_bd_intf_pin -mode Slave -vlnv xilinx.com:interface:aximm_rtl:1.0 S_AXI
create_bd_intf_pin -mode Monitor -vlnv UF:user:deimos_data_input_rtl:1.0 ddi0
create_bd_pin -dir I -type clk AXI_CLK_OUT
create_bd_pin -dir I -type rst AXI_RSTn
create_bd_pin -dir I -type clk daq_clk
create_bd_pin -dir O daq_spy_full
create_bd_pin -dir I -type rst daq_spy_reset
create_bd_pin -dir I -from 14 -to 0 rec_time_0
create_bd_pin -dir O -from 14 -to 0 spy_addr_0
create_bd_pin -dir I trigger
create_bd_pin -dir I -type rst ts_rst

create_bd_cell -type ip -vlnv xilinx.com:ip:axi_bram_ctrl:4.1 axi_bram_ctrl_0
set_property -dict {CONFIG.DATA_WIDTH 64 CONFIG.SINGLE_PORT_BRAM 1} [get_bd_cells axi_bram_ctrl_0]
create_bd_cell -type module -reference daq_spy_control daq_spy_control_0

# ---- hierarchy /daq_spy_all/daq_spy_2 ----
current_bd_instance /daq_spy_all/daq_spy_2
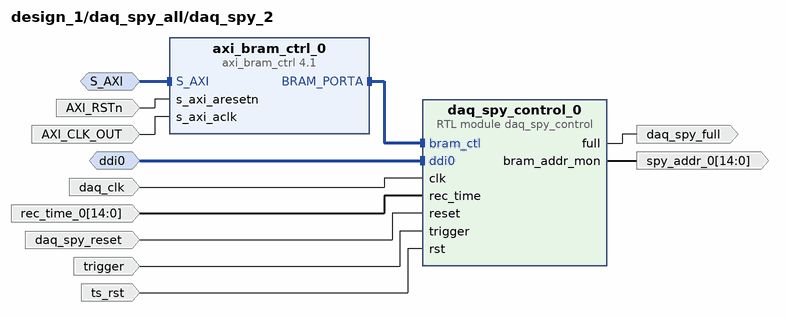
[diagram p14: block diagram inside /daq_spy_all/daq_spy_2]
create_bd_intf_pin -mode Slave -vlnv xilinx.com:interface:aximm_rtl:1.0 S_AXI
create_bd_intf_pin -mode Monitor -vlnv UF:user:deimos_data_input_rtl:1.0 ddi0
create_bd_pin -dir I -type clk AXI_CLK_OUT
create_bd_pin -dir I -type rst AXI_RSTn
create_bd_pin -dir I -type clk daq_clk
create_bd_pin -dir O daq_spy_full
create_bd_pin -dir I -type rst daq_spy_reset
create_bd_pin -dir I -from 14 -to 0 rec_time_0
create_bd_pin -dir O -from 14 -to 0 spy_addr_0
create_bd_pin -dir I trigger
create_bd_pin -dir I -type rst ts_rst

create_bd_cell -type ip -vlnv xilinx.com:ip:axi_bram_ctrl:4.1 axi_bram_ctrl_0
set_property -dict {CONFIG.DATA_WIDTH 64 CONFIG.SINGLE_PORT_BRAM 1} [get_bd_cells axi_bram_ctrl_0]
create_bd_cell -type module -reference daq_spy_control daq_spy_control_0

# ---- connections ----

current_bd_instance /coldata_i2c_dual0
connect_bd_intf_net [get_bd_intf_pins S00_AXI] [get_bd_intf_pins coldata_i2c_0/S00_AXI]
connect_bd_net -net clk62p5_1 [get_bd_pins clk62p5] [get_bd_pins coldata_i2c_0/clk62p5]
connect_bd_net [get_bd_pins coldata_i2c_0/scl] [get_bd_pins util_ds_buf_0/OBUF_IN]
connect_bd_net [get_bd_pins coldata_i2c_0/scl_out] [get_bd_pins scl_out]
connect_bd_net [get_bd_pins coldata_i2c_0/sda_in_out] [get_bd_pins sda_in_out]
connect_bd_net [get_bd_pins coldata_i2c_0/sda_out_n] [get_bd_pins sda_out_n_0]
connect_bd_net [get_bd_pins coldata_i2c_0/sda_out_out] [get_bd_pins sda_out_out]
connect_bd_net [get_bd_pins coldata_i2c_0/sda_out_p] [get_bd_pins sda_out_p_0]
connect_bd_net -net rst_ps8_0_99M_peripheral_aresetn [get_bd_pins s00_axi_aresetn] [get_bd_pins coldata_i2c_0/s00_axi_aresetn]
connect_bd_net -net sda_in_n_0_1 [get_bd_pins sda_in_n_0] [get_bd_pins coldata_i2c_0/sda_in_n]
connect_bd_net -net sda_in_p_0_1 [get_bd_pins sda_in_p_0] [get_bd_pins coldata_i2c_0/sda_in_p]
connect_bd_net [get_bd_pins util_ds_buf_0/OBUF_DS_N] [get_bd_pins scl_n_0]
connect_bd_net [get_bd_pins util_ds_buf_0/OBUF_DS_P] [get_bd_pins scl_p_0]
connect_bd_net -net zynq_ultra_ps_e_0_pl_clk0 [get_bd_pins s00_axi_aclk] [get_bd_pins coldata_i2c_0/s00_axi_aclk]

current_bd_instance /coldata_i2c_dual1
connect_bd_intf_net [get_bd_intf_pins S00_AXI] [get_bd_intf_pins coldata_i2c_0/S00_AXI]
connect_bd_net -net clk62p5_1 [get_bd_pins clk62p5] [get_bd_pins coldata_i2c_0/clk62p5]
connect_bd_net [get_bd_pins coldata_i2c_0/scl] [get_bd_pins util_ds_buf_0/OBUF_IN]
connect_bd_net [get_bd_pins coldata_i2c_0/sda_out_n] [get_bd_pins sda_out_n_0]
connect_bd_net [get_bd_pins coldata_i2c_0/sda_out_p] [get_bd_pins sda_out_p_0]
connect_bd_net [get_bd_pins s00_axi_aresetn] [get_bd_pins coldata_i2c_0/s00_axi_aresetn]
connect_bd_net -net sda_in_n_0_1 [get_bd_pins sda_in_n_0] [get_bd_pins coldata_i2c_0/sda_in_n]
connect_bd_net -net sda_in_p_0_1 [get_bd_pins sda_in_p_0] [get_bd_pins coldata_i2c_0/sda_in_p]
connect_bd_net [get_bd_pins util_ds_buf_0/OBUF_DS_N] [get_bd_pins scl_n_0]
connect_bd_net [get_bd_pins util_ds_buf_0/OBUF_DS_P] [get_bd_pins scl_p_0]
connect_bd_net -net zynq_ultra_ps_e_0_pl_clk0 [get_bd_pins s00_axi_aclk] [get_bd_pins coldata_i2c_0/s00_axi_aclk]

current_bd_instance /coldata_i2c_dual2
connect_bd_intf_net [get_bd_intf_pins S00_AXI] [get_bd_intf_pins coldata_i2c_0/S00_AXI]
connect_bd_net -net clk62p5_1 [get_bd_pins clk62p5] [get_bd_pins coldata_i2c_0/clk62p5]
connect_bd_net [get_bd_pins coldata_i2c_0/scl] [get_bd_pins util_ds_buf_0/OBUF_IN]
connect_bd_net [get_bd_pins coldata_i2c_0/sda_out_n] [get_bd_pins sda_out_n_0]
connect_bd_net [get_bd_pins coldata_i2c_0/sda_out_p] [get_bd_pins sda_out_p_0]
connect_bd_net [get_bd_pins s00_axi_aresetn] [get_bd_pins coldata_i2c_0/s00_axi_aresetn]
connect_bd_net -net sda_in_n_0_1 [get_bd_pins sda_in_n_0] [get_bd_pins coldata_i2c_0/sda_in_n]
connect_bd_net -net sda_in_p_0_1 [get_bd_pins sda_in_p_0] [get_bd_pins coldata_i2c_0/sda_in_p]
connect_bd_net [get_bd_pins util_ds_buf_0/OBUF_DS_N] [get_bd_pins scl_n_0]
connect_bd_net [get_bd_pins util_ds_buf_0/OBUF_DS_P] [get_bd_pins scl_p_0]
connect_bd_net -net zynq_ultra_ps_e_0_pl_clk0 [get_bd_pins s00_axi_aclk] [get_bd_pins coldata_i2c_0/s00_axi_aclk]

current_bd_instance /coldata_i2c_dual3
connect_bd_intf_net [get_bd_intf_pins S00_AXI] [get_bd_intf_pins coldata_i2c_0/S00_AXI]
connect_bd_net -net clk62p5_1 [get_bd_pins clk62p5] [get_bd_pins coldata_i2c_0/clk62p5]
connect_bd_net [get_bd_pins coldata_i2c_0/scl] [get_bd_pins util_ds_buf_0/OBUF_IN]
connect_bd_net [get_bd_pins coldata_i2c_0/sda_out_n] [get_bd_pins sda_out_n_0]
connect_bd_net [get_bd_pins coldata_i2c_0/sda_out_p] [get_bd_pins sda_out_p_0]
connect_bd_net [get_bd_pins s00_axi_aresetn] [get_bd_pins coldata_i2c_0/s00_axi_aresetn]
connect_bd_net -net sda_in_n_0_1 [get_bd_pins sda_in_n_0] [get_bd_pins coldata_i2c_0/sda_in_n]
connect_bd_net -net sda_in_p_0_1 [get_bd_pins sda_in_p_0] [get_bd_pins coldata_i2c_0/sda_in_p]
connect_bd_net [get_bd_pins util_ds_buf_0/OBUF_DS_N] [get_bd_pins scl_n_0]
connect_bd_net [get_bd_pins util_ds_buf_0/OBUF_DS_P] [get_bd_pins scl_p_0]
connect_bd_net -net zynq_ultra_ps_e_0_pl_clk0 [get_bd_pins s00_axi_aclk] [get_bd_pins coldata_i2c_0/s00_axi_aclk]

current_bd_instance /dbg
connect_bd_intf_net [get_bd_intf_pins debug_bridge_0/m0_bscan] [get_bd_intf_pins debug_bridge_1/S_BSCAN]
connect_bd_intf_net [get_bd_intf_pins S_AXI] [get_bd_intf_pins debug_bridge_0/S_AXI]
connect_bd_net -net rst_ps8_0_99M_peripheral_aresetn [get_bd_pins AXI_RSTn] [get_bd_pins debug_bridge_0/s_axi_aresetn]
connect_bd_net -net zynq_ultra_ps_e_0_pl_clk0 [get_bd_pins AXI_CLK_OUT] [get_bd_pins debug_bridge_0/s_axi_aclk] [get_bd_pins debug_bridge_1/clk]

current_bd_instance /daq_spy_all
connect_bd_intf_net [get_bd_intf_pins S_AXI1] [get_bd_intf_pins daq_spy_1/S_AXI]
connect_bd_intf_net [get_bd_intf_pins S_AXI2] [get_bd_intf_pins daq_spy_3/S_AXI]
connect_bd_intf_net [get_bd_intf_pins S_AXI3] [get_bd_intf_pins daq_spy_7/S_AXI]
connect_bd_intf_net [get_bd_intf_pins S_AXI4] [get_bd_intf_pins daq_spy_5/S_AXI]
connect_bd_intf_net [get_bd_intf_pins S_AXI5] [get_bd_intf_pins daq_spy_4/S_AXI]
connect_bd_intf_net [get_bd_intf_pins S_AXI6] [get_bd_intf_pins daq_spy_6/S_AXI]
connect_bd_intf_net [get_bd_intf_pins S_AXI7] [get_bd_intf_pins daq_spy_2/S_AXI]
connect_bd_intf_net [get_bd_intf_pins daq_spy_1/ddi0] [get_bd_intf_pins ddi1]
connect_bd_intf_net [get_bd_intf_pins daq_spy_3/ddi0] [get_bd_intf_pins ddi3]
connect_bd_intf_net [get_bd_intf_pins daq_spy_7/ddi0] [get_bd_intf_pins ddi7]
connect_bd_intf_net [get_bd_intf_pins daq_spy_5/ddi0] [get_bd_intf_pins ddi5]
connect_bd_intf_net [get_bd_intf_pins daq_spy_4/ddi0] [get_bd_intf_pins ddi4]
connect_bd_intf_net [get_bd_intf_pins daq_spy_6/ddi0] [get_bd_intf_pins ddi6]
connect_bd_intf_net [get_bd_intf_pins daq_spy_2/ddi0] [get_bd_intf_pins ddi2]
connect_bd_intf_net [get_bd_intf_pins ddi0] [get_bd_intf_pins daq_spy_0/ddi0]
connect_bd_intf_net [get_bd_intf_pins S_AXI] [get_bd_intf_pins daq_spy_0/S_AXI]
connect_bd_net -net clk_0_1 [get_bd_pins ddi_clk] \
  [get_bd_pins daq_spy_0/daq_clk] [get_bd_pins daq_spy_2/daq_clk] [get_bd_pins daq_spy_4/daq_clk] \
  [get_bd_pins daq_spy_5/daq_clk] [get_bd_pins daq_spy_7/daq_clk] [get_bd_pins daq_spy_3/daq_clk] \
  [get_bd_pins daq_spy_1/daq_clk] [get_bd_pins daq_spy_6/daq_clk]
connect_bd_net -net daq_spy_1_daq_spy_full [get_bd_pins daq_spy_0/daq_spy_full] [get_bd_pins daq_spy_full_0]
connect_bd_net [get_bd_pins daq_spy_1/daq_spy_full] [get_bd_pins daq_spy_full_1]
connect_bd_net -net daq_spy_1_spy_addr_0 [get_bd_pins daq_spy_0/spy_addr_0] [get_bd_pins spy_addr_0]
connect_bd_net [get_bd_pins daq_spy_1/spy_addr_0] [get_bd_pins spy_addr_1]
connect_bd_net [get_bd_pins daq_spy_2/daq_spy_full] [get_bd_pins daq_spy_full_2]
connect_bd_net [get_bd_pins daq_spy_2/spy_addr_0] [get_bd_pins spy_addr_2]
connect_bd_net [get_bd_pins daq_spy_3/daq_spy_full] [get_bd_pins daq_spy_full_3]
connect_bd_net [get_bd_pins daq_spy_3/spy_addr_0] [get_bd_pins spy_addr_3]
connect_bd_net [get_bd_pins daq_spy_4/daq_spy_full] [get_bd_pins daq_spy_full_4]
connect_bd_net [get_bd_pins daq_spy_4/spy_addr_0] [get_bd_pins spy_addr_4]
connect_bd_net [get_bd_pins daq_spy_5/daq_spy_full] [get_bd_pins daq_spy_full_5]
connect_bd_net [get_bd_pins daq_spy_5/spy_addr_0] [get_bd_pins spy_addr_5]
connect_bd_net [get_bd_pins daq_spy_6/daq_spy_full] [get_bd_pins daq_spy_full_6]
connect_bd_net [get_bd_pins daq_spy_6/spy_addr_0] [get_bd_pins spy_addr_6]
connect_bd_net [get_bd_pins daq_spy_7/daq_spy_full] [get_bd_pins daq_spy_full_7]
connect_bd_net [get_bd_pins daq_spy_7/spy_addr_0] [get_bd_pins spy_addr_7]
connect_bd_net -net daq_spy_reset_0_1 [get_bd_pins daq_spy_reset_1] \
  [get_bd_pins daq_spy_0/daq_spy_reset] [get_bd_pins daq_spy_2/daq_spy_reset] [get_bd_pins daq_spy_6/daq_spy_reset] \
  [get_bd_pins daq_spy_4/daq_spy_reset] [get_bd_pins daq_spy_5/daq_spy_reset] [get_bd_pins daq_spy_7/daq_spy_reset] \
  [get_bd_pins daq_spy_3/daq_spy_reset] [get_bd_pins daq_spy_1/daq_spy_reset]
connect_bd_net -net rec_time_0_1 [get_bd_pins spy_rec_time] \
  [get_bd_pins daq_spy_0/rec_time_0] [get_bd_pins daq_spy_2/rec_time_0] [get_bd_pins daq_spy_6/rec_time_0] \
  [get_bd_pins daq_spy_4/rec_time_0] [get_bd_pins daq_spy_5/rec_time_0] [get_bd_pins daq_spy_7/rec_time_0] \
  [get_bd_pins daq_spy_3/rec_time_0] [get_bd_pins daq_spy_1/rec_time_0]
connect_bd_net -net rst_0_1 [get_bd_pins ts_rst] \
  [get_bd_pins daq_spy_0/ts_rst] [get_bd_pins daq_spy_6/ts_rst] [get_bd_pins daq_spy_2/ts_rst] [get_bd_pins daq_spy_4/ts_rst] \
  [get_bd_pins daq_spy_5/ts_rst] [get_bd_pins daq_spy_7/ts_rst] [get_bd_pins daq_spy_3/ts_rst] [get_bd_pins daq_spy_1/ts_rst]
connect_bd_net -net rst_ps8_0_99M_peripheral_aresetn [get_bd_pins AXI_RSTn] \
  [get_bd_pins daq_spy_0/AXI_RSTn] [get_bd_pins daq_spy_1/AXI_RSTn] [get_bd_pins daq_spy_3/AXI_RSTn] \
  [get_bd_pins daq_spy_7/AXI_RSTn] [get_bd_pins daq_spy_5/AXI_RSTn] [get_bd_pins daq_spy_4/AXI_RSTn] \
  [get_bd_pins daq_spy_6/AXI_RSTn] [get_bd_pins daq_spy_2/AXI_RSTn]
connect_bd_net -net trigger_0_1 [get_bd_pins cmd_bit_trigger] \
  [get_bd_pins daq_spy_0/trigger] [get_bd_pins daq_spy_2/trigger] [get_bd_pins daq_spy_6/trigger] \
  [get_bd_pins daq_spy_4/trigger] [get_bd_pins daq_spy_5/trigger] [get_bd_pins daq_spy_7/trigger] \
  [get_bd_pins daq_spy_3/trigger] [get_bd_pins daq_spy_1/trigger]
connect_bd_net -net zynq_ultra_ps_e_0_pl_clk0 [get_bd_pins AXI_CLK_OUT] \
  [get_bd_pins daq_spy_0/AXI_CLK_OUT] [get_bd_pins daq_spy_1/AXI_CLK_OUT] [get_bd_pins daq_spy_3/AXI_CLK_OUT] \
  [get_bd_pins daq_spy_7/AXI_CLK_OUT] [get_bd_pins daq_spy_5/AXI_CLK_OUT] [get_bd_pins daq_spy_4/AXI_CLK_OUT] \
  [get_bd_pins daq_spy_6/AXI_CLK_OUT] [get_bd_pins daq_spy_2/AXI_CLK_OUT]

current_bd_instance /daq_spy_all/daq_spy_1
connect_bd_intf_net [get_bd_intf_pins ddi0] [get_bd_intf_pins daq_spy_control_0/ddi0]
connect_bd_intf_net [get_bd_intf_pins daq_spy_control_0/bram_ctl] [get_bd_intf_pins axi_bram_ctrl_0/BRAM_PORTA]
connect_bd_intf_net [get_bd_intf_pins S_AXI] [get_bd_intf_pins axi_bram_ctrl_0/S_AXI]
connect_bd_net [get_bd_pins AXI_RSTn] [get_bd_pins axi_bram_ctrl_0/s_axi_aresetn]
connect_bd_net -net daq_clk_0_1 [get_bd_pins daq_clk] [get_bd_pins daq_spy_control_0/clk]
connect_bd_net [get_bd_pins daq_spy_control_0/bram_addr_mon] [get_bd_pins spy_addr_0]
connect_bd_net -net daq_spy_full_0 [get_bd_pins daq_spy_control_0/full] [get_bd_pins daq_spy_full]
connect_bd_net -net rec_time_0_1 [get_bd_pins rec_time_0] [get_bd_pins daq_spy_control_0/rec_time]
connect_bd_net -net reset_0_1 [get_bd_pins daq_spy_reset] [get_bd_pins daq_spy_control_0/reset]
connect_bd_net [get_bd_pins trigger] [get_bd_pins daq_spy_control_0/trigger]
connect_bd_net [get_bd_pins ts_rst] [get_bd_pins daq_spy_control_0/rst]
connect_bd_net -net zynq_ultra_ps_e_0_pl_clk0 [get_bd_pins AXI_CLK_OUT] [get_bd_pins axi_bram_ctrl_0/s_axi_aclk]

current_bd_instance /daq_spy_all/daq_spy_3
connect_bd_intf_net [get_bd_intf_pins ddi0] [get_bd_intf_pins daq_spy_control_0/ddi0]
connect_bd_intf_net [get_bd_intf_pins axi_bram_ctrl_0/BRAM_PORTA] [get_bd_intf_pins daq_spy_control_0/bram_ctl]
connect_bd_intf_net [get_bd_intf_pins S_AXI] [get_bd_intf_pins axi_bram_ctrl_0/S_AXI]
connect_bd_net [get_bd_pins AXI_RSTn] [get_bd_pins axi_bram_ctrl_0/s_axi_aresetn]
connect_bd_net -net daq_clk_0_1 [get_bd_pins daq_clk] [get_bd_pins daq_spy_control_0/clk]
connect_bd_net [get_bd_pins daq_spy_control_0/bram_addr_mon] [get_bd_pins spy_addr_0]
connect_bd_net -net daq_spy_full_0 [get_bd_pins daq_spy_control_0/full] [get_bd_pins daq_spy_full]
connect_bd_net -net rec_time_0_1 [get_bd_pins rec_time_0] [get_bd_pins daq_spy_control_0/rec_time]
connect_bd_net -net reset_0_1 [get_bd_pins daq_spy_reset] [get_bd_pins daq_spy_control_0/reset]
connect_bd_net [get_bd_pins trigger] [get_bd_pins daq_spy_control_0/trigger]
connect_bd_net [get_bd_pins ts_rst] [get_bd_pins daq_spy_control_0/rst]
connect_bd_net -net zynq_ultra_ps_e_0_pl_clk0 [get_bd_pins AXI_CLK_OUT] [get_bd_pins axi_bram_ctrl_0/s_axi_aclk]

current_bd_instance /daq_spy_all/daq_spy_4
connect_bd_intf_net [get_bd_intf_pins ddi0] [get_bd_intf_pins daq_spy_control_0/ddi0]
connect_bd_intf_net [get_bd_intf_pins daq_spy_control_0/bram_ctl] [get_bd_intf_pins axi_bram_ctrl_0/BRAM_PORTA]
connect_bd_intf_net [get_bd_intf_pins S_AXI] [get_bd_intf_pins axi_bram_ctrl_0/S_AXI]
connect_bd_net [get_bd_pins AXI_RSTn] [get_bd_pins axi_bram_ctrl_0/s_axi_aresetn]
connect_bd_net -net daq_clk_0_1 [get_bd_pins daq_clk] [get_bd_pins daq_spy_control_0/clk]
connect_bd_net [get_bd_pins daq_spy_control_0/bram_addr_mon] [get_bd_pins spy_addr_0]
connect_bd_net -net daq_spy_full_0 [get_bd_pins daq_spy_control_0/full] [get_bd_pins daq_spy_full]
connect_bd_net -net rec_time_0_1 [get_bd_pins rec_time_0] [get_bd_pins daq_spy_control_0/rec_time]
connect_bd_net -net reset_0_1 [get_bd_pins daq_spy_reset] [get_bd_pins daq_spy_control_0/reset]
connect_bd_net [get_bd_pins trigger] [get_bd_pins daq_spy_control_0/trigger]
connect_bd_net [get_bd_pins ts_rst] [get_bd_pins daq_spy_control_0/rst]
connect_bd_net -net zynq_ultra_ps_e_0_pl_clk0 [get_bd_pins AXI_CLK_OUT] [get_bd_pins axi_bram_ctrl_0/s_axi_aclk]
